# EAGLE schematic untitled (EAGLE 7.7.0)
REV: 1
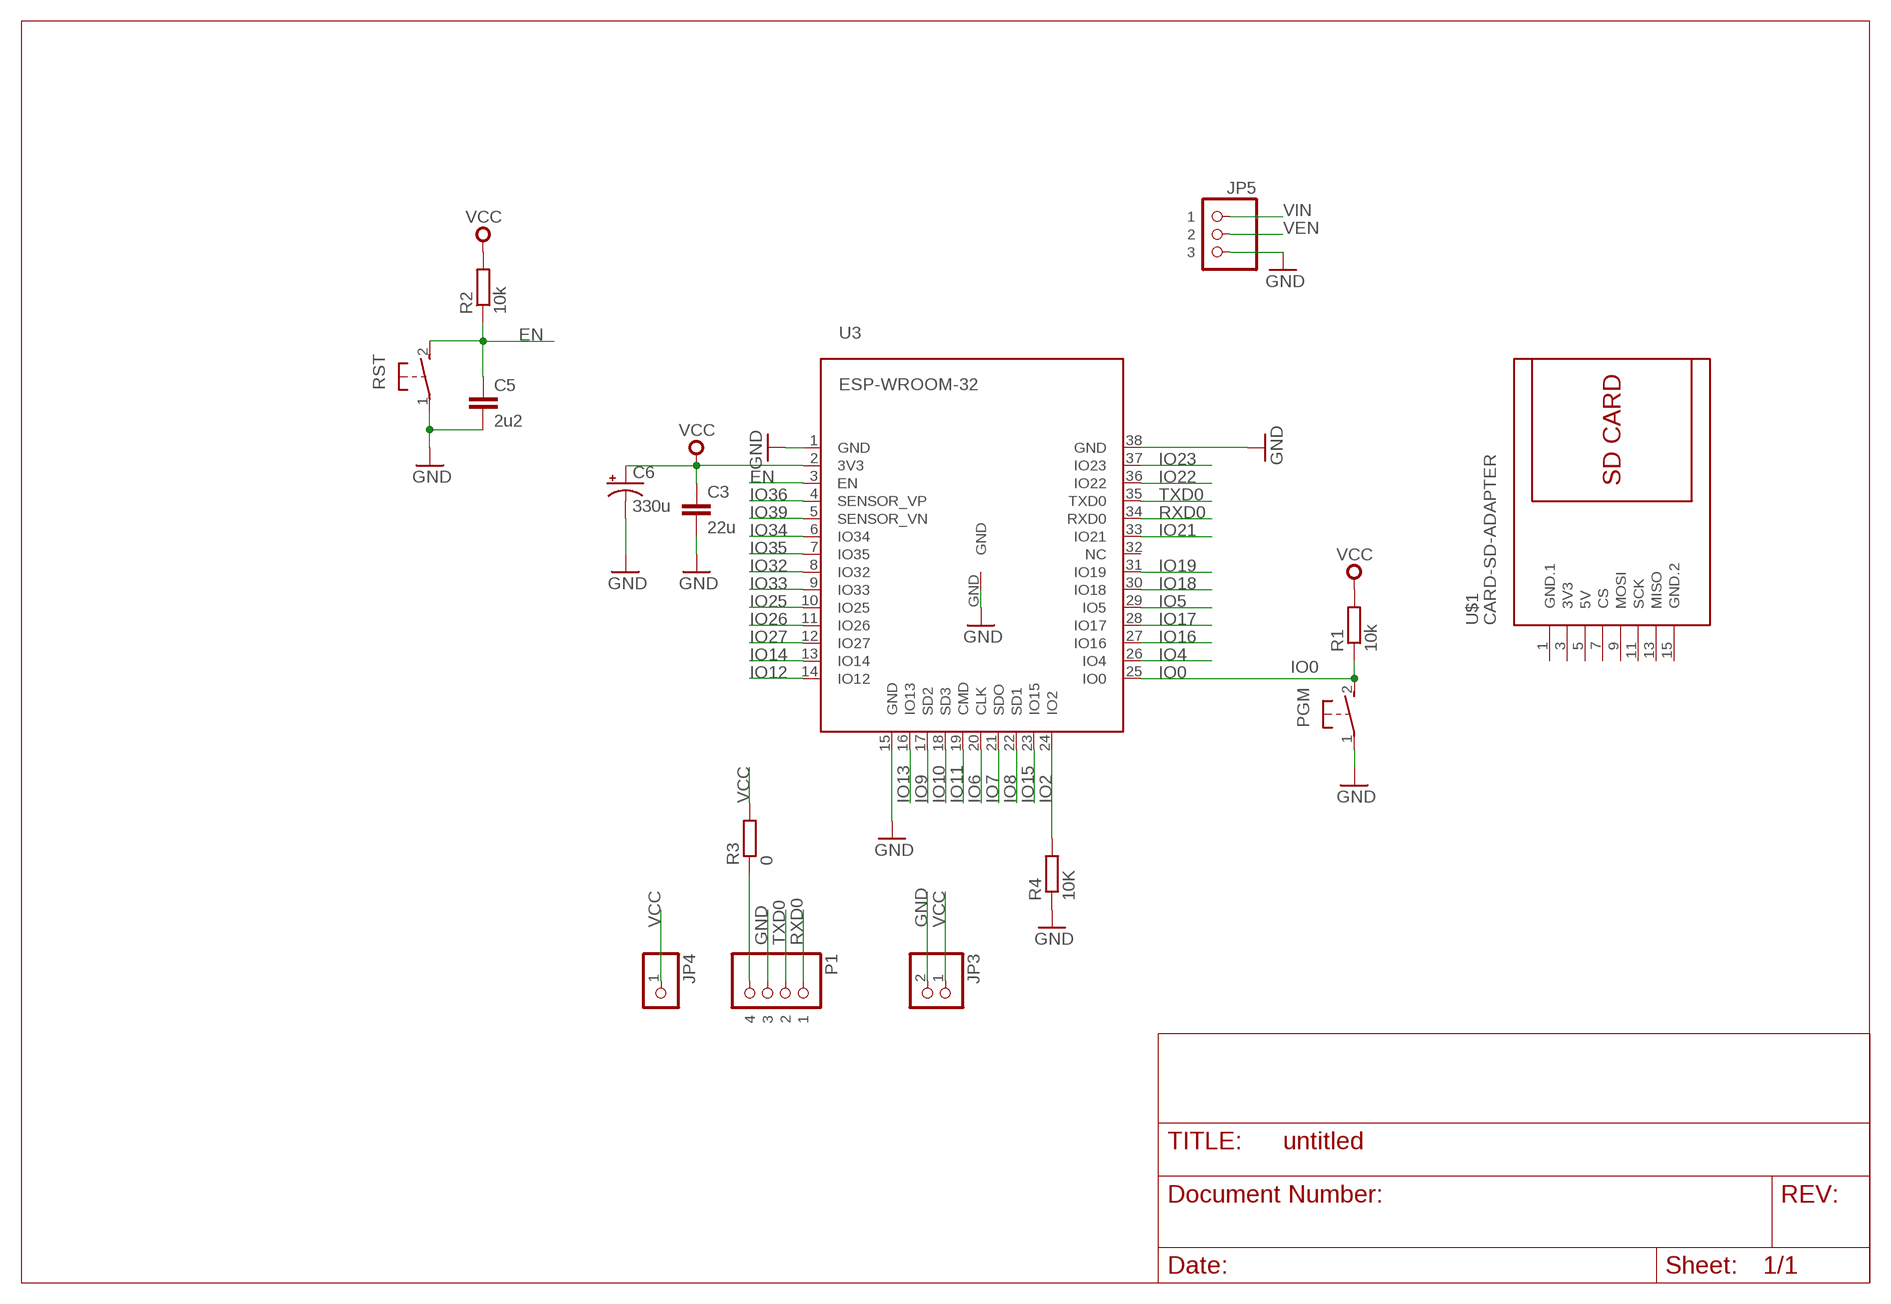
[diagram p0: schematic, sheet 1]

## Parts
C3  22u  CAP0805  [0805]
C5  2u2  C-EUC0603  [C0603]
C6  330u  CAP_POLSMD  [VISHAY_C]
JP3  HEADER-1X2ROUND  [1X02_ROUND]
JP4  HEADER-1X1ROUND  [1X01_ROUND]
JP5  HEADER-1X3ROUND  [1X03_ROUND]
P1  HEADER-1X4ROUND  [1X04_ROUND]
PGM  DTSM-3  [DTSM-3]
R1  10k  R-EU_R0603  [R0603]
R2  10k  R-EU_R0603  [R0603]
R3  0  R-EU_R0603  [R0603]
R4  10K  R-EU_R0603  [R0603]
RST  DTSM-3  [DTSM-3]
U3  ESP-WROOM-32  [ESP-WROOM-32]
U$1  CARD-SD-ADAPTER  [CARD-SD-ADAPTER]

## Nets
EN: C5.1 R2.1 RST.2 U3.3(EN)
GND [gnd]: C3.2 C5.2 C6.- JP3.2 JP5.3 P1.3 PGM.1 R4.1 RST.1 U3.1(GND) U3.15(GND) U3.38(GND) U3.GND
IO0: PGM.2 R1.1 U3.25(IO0)
IO2: R4.2 U3.24(IO2)
IO4: U3.26(IO4)
IO5: U3.29(IO5)
IO6: U3.20(CLK)
IO7: U3.21(SDO)
IO8: U3.22(SD1)
IO9: U3.17(SD2)
IO10: U3.18(SD3)
IO11: U3.19(CMD)
IO12: U3.14(IO12)
IO13: U3.16(IO13)
IO14: U3.13(IO14)
IO15: U3.23(IO15)
IO16: U3.27(IO16)
IO17: U3.28(IO17)
IO18: U3.30(IO18)
IO19: U3.31(IO19)
IO21: U3.33(IO21)
IO22: U3.36(IO22)
IO23: U3.37(IO23)
IO25: U3.10(IO25)
IO26: U3.11(IO26)
IO27: U3.12(IO27)
IO32: U3.8(IO32)
IO33: U3.9(IO33)
IO34: U3.6(IO34)
IO35: U3.7(IO35)
IO36: U3.4(SENSOR_VP)
IO39: U3.5(SENSOR_VN)
N$1: P1.4 R3.1
RXD0: P1.1 U3.34(RXD0)
TXD0: P1.2 U3.35(TXD0)
VCC [vcc]: C3.1 C6.+ JP3.1 JP4.1 R1.2 R2.2 R3.2 U3.2(3V3)
VEN: JP5.2
VIN: JP5.1
Unconnected: U3.32(NC) U$1.7(CS) U$1.9(MOSI) U$1.11(SCK) U$1.13(MISO)

## Power pins joined to a net without a drawn wire
3V3: U$1.3(3V3)
5V: U$1.5(5V)
GND.1: U$1.1(GND.1)
GND.2: U$1.15(GND.2)

## Library data of the parts
C3 = SparkFun-Passives:CAP: Capacitor Standard 0603 ceramic capacitor, and 0.1" leaded capacitor.
C5 = rcl:C-EU: CAPACITOR, European symbol
C6 = SparkFun-Passives:CAP_POL: Capacitor Polarized These are standard SMD and PTH capacitors. Normally 10uF, 47uF, and 100uF in electrolytic and tantalum varieties. Always verify the external diameter of the through hole cap, it varies with capacity, voltage, and manufacturer. The EIA devices should be standard.
JP3 = hari:HEADER-1X2: PIN HEADER
JP4 = hari:HEADER-1X1: PIN HEADER
JP5 = hari:HEADER-1X3: PIN HEADER
P1 = hari:HEADER-1X4: PIN HEADER
PGM RST = switch-tact:DTSM-3
R1-R4 = rcl:R-EU_: RESISTOR, European symbol
U3 = esp32:ESP-WROOM-32
U$1 = diy-modules:CARD-SD-ADAPTER: Full Size SD Card Adapter Module with onboard 3.3V regulator Guide describing how to use SD card with Arduino is available here: https://www.arduino.cc/en/Reference/SDCardNotes Click here to find device on ebay.com <http://www.ebay.com/sch/sd+card+socket+module>

## Net classes
0 default: width 0.254 mm, drill 0.305 mm, clearance 0.152 mm
1 gnd: width 0.635 mm, drill 0.635 mm, clearance 0.254 mm
2 vcc: width 0.406 mm, drill 0.406 mm, clearance 0.254 mm